# Altium schematic sheet 4.3寸MCU_RGB.SchDoc
size A4
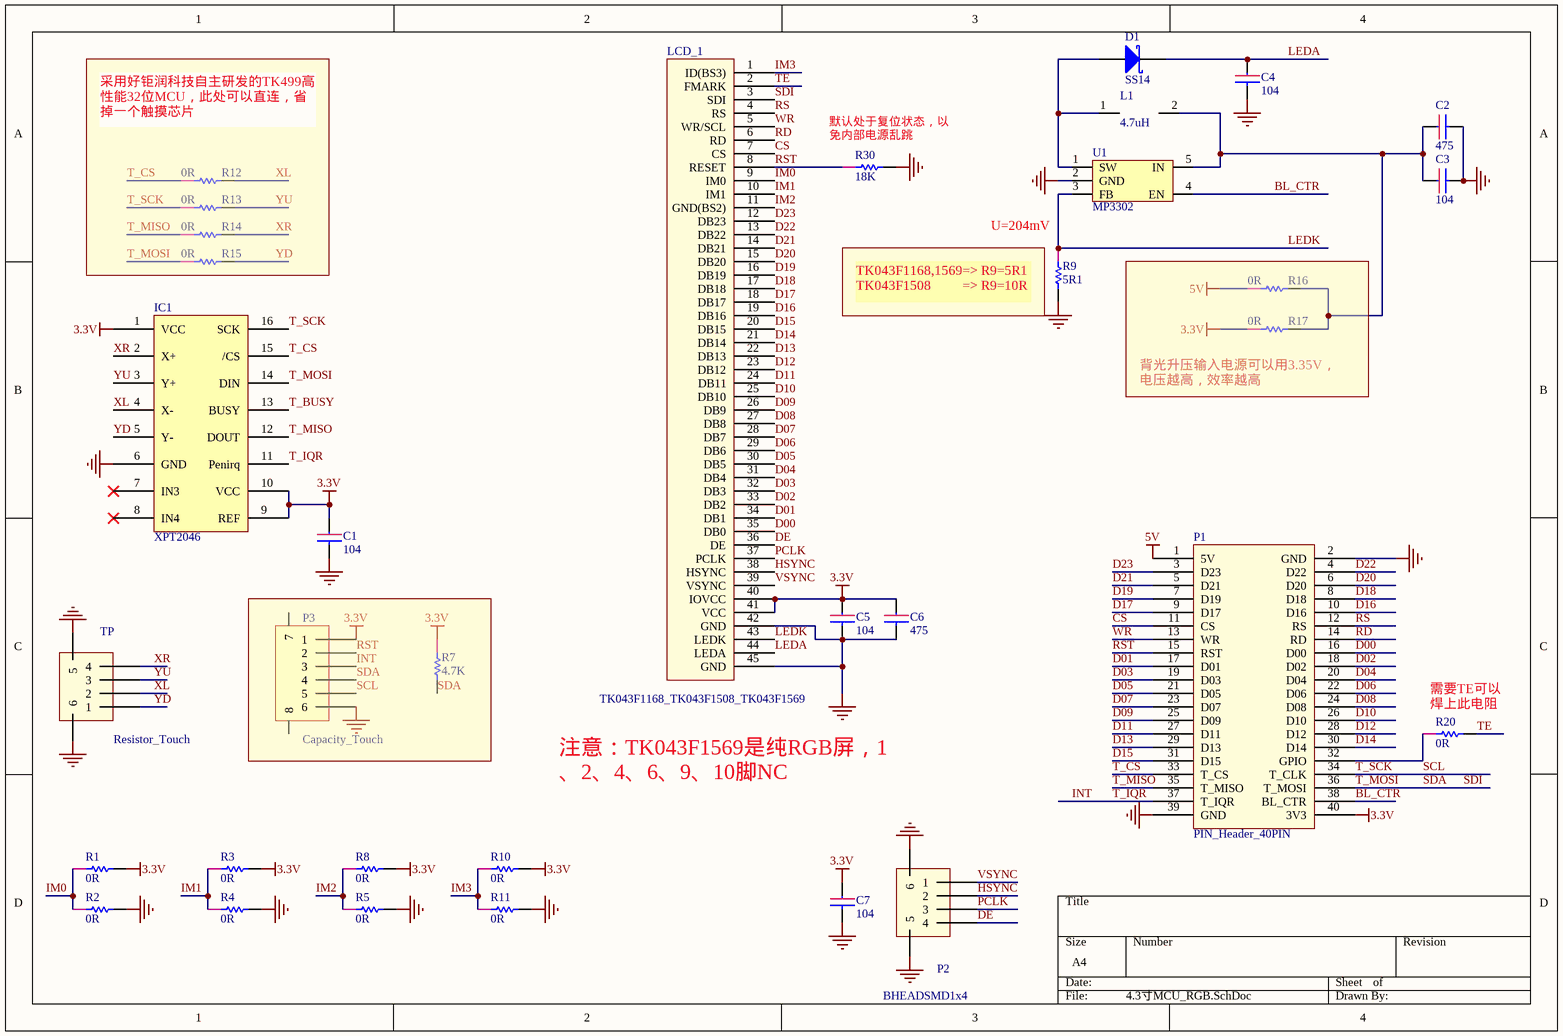
[diagram p0: 4.3寸MCU_RGB.SchDoc]

## Parts
C1  104  [C0603-1]
C2  475  [C0603-2]
C3  104  [C0603-1]
C4  104  [C0603-2]
C5  104  [C0603-1]
C6  475  [C0603-2]
C7  104  [C0603-1]
D1  SS14  [SOD123]
IC1  XPT2046  [SOT403-1]
L1  4.7uH  [L1206]
LCD_1  TK043F1168_TK043F1508_TK043F1569  [TFT_KGM1066A0]
P1  PIN_Header_40PIN  [P_Head_2x20]
P2  BHEADSMD1x4  [BHEADSMD1x4]
P3  Capacity_Touch  [TP_Cap_4.3inch]
R1  0R  [R0603]
R2  0R  [R0603]
R3  0R  [R0603]
R4  0R  [R0603]
R5  0R  [R0603]
R7  4.7K  [R0603]
R8  0R  [R0603]
R9  5R1  [R0603]
R10  0R  [R0603]
R11  0R  [R0603]
R12  0R  [R0402]
R13  0R  [R0402]
R14  0R  [R0402]
R15  0R  [R0402]
R16  0R  [R0603]
R17  0R  [R0603]
R20  0R  [R0603]
R30  18K  [R0603]
TP  Resistor_Touch  [TP_5.0inch]
U1  MP3302  [SOT23-5]

## Nets
3.3V: C1.1 C5.1 C6.1 C7.1 IC1.1(VCC) IC1.9(REF) IC1.10(VCC) LCD_1.40(IOVCC) LCD_1.41(VCC) P1.40(3V3) P3.1 R1.2 R3.2 R7.1 R8.2 R10.2 R17.1
5V: P1.1(5V) R16.1
GND: C1.2 C2.2 C3.2 C4.2 C5.2 C6.2 C7.2 IC1.6(GND) LCD_1.42(GND) LCD_1.45(GND) P1.2(GND) P1.39(GND) P2.5 P2.6 P3.6 R2.2 R4.2 R5.2 R9.2 R11.2 R30.2 TP.5 TP.6 U1.2(GND)
BL_CTR: P1.38(BL_CTR) U1.4(EN)
CS: LCD_1.7(CS) P1.11(CS)
D00: LCD_1.35(DB0) P1.16(D00)
D01: LCD_1.34(DB1) P1.17(D01)
D02: LCD_1.33(DB2) P1.18(D02)
D03: LCD_1.32(DB3) P1.19(D03)
D04: LCD_1.31(DB4) P1.20(D04)
D05: LCD_1.30(DB5) P1.21(D05)
D06: LCD_1.29(DB6) P1.22(D06)
D07: LCD_1.28(DB7) P1.23(D07)
D08: LCD_1.27(DB8) P1.24(D08)
D09: LCD_1.26(DB9) P1.25(D09)
D10: LCD_1.25(DB10) P1.26(D10)
D11: LCD_1.24(DB11) P1.27(D11)
D12: LCD_1.23(DB12) P1.28(D12)
D13: LCD_1.22(DB13) P1.29(D13)
D14: LCD_1.21(DB14) P1.30(D14)
D15: LCD_1.20(DB15) P1.31(D15)
D16: LCD_1.19(DB16) P1.10(D16)
D17: LCD_1.18(DB17) P1.9(D17)
D18: LCD_1.17(DB18) P1.8(D18)
D19: LCD_1.16(DB19) P1.7(D19)
D20: LCD_1.15(DB20) P1.6(D20)
D21: LCD_1.14(DB21) P1.5(D21)
D22: LCD_1.13(DB22) P1.4(D22)
D23: LCD_1.12(DB23) P1.3(D23)
DE: LCD_1.36(DE) P2.4
HSYNC: LCD_1.38(HSYNC) P2.2
IM0: LCD_1.9(IM0) R1.1 R2.1
IM1: LCD_1.10(IM1) R3.1 R4.1
IM2: LCD_1.11(GND(BS2)) R5.1 R8.1
IM3: LCD_1.1(ID(BS3)) R10.1 R11.1
INT: IC1.11(Penirq) P1.37(T_IQR) P3.3  [also labelled T_IQR]
LEDA: C4.1 D1.2(K) LCD_1.44(LEDA)
LEDK: LCD_1.43(LEDK) R9.1 U1.3(FB)
PCLK: LCD_1.37(PCLK) P2.3
RD: LCD_1.6(RD) P1.14(RD)
RS: LCD_1.4(RS) P1.12(RS)
RST: LCD_1.8(RESET) P1.15(RST) P3.2 R30.1
SCL: IC1.16(SCK) P1.34(T_CLK) P3.5 R13.1  [also labelled T_SCK]
SDA: IC1.14(DIN) LCD_1.3(SDI) P1.36(T_MOSI) P3.4 R7.2 R15.1  [also labelled SDI, T_MOSI]
T_BUSY: IC1.13(BUSY)
T_CS: IC1.15(/CS) P1.33(T_CS) R12.1
T_MISO: IC1.12(DOUT) P1.35(T_MISO) R14.1
TE: LCD_1.2(FMARK) R20.2
VSYNC: LCD_1.39(VSYNC) P2.1
WR: LCD_1.5(WR/SCL) P1.13(WR)
XL: IC1.4(X-) R12.2 TP.2
XR: IC1.2(X+) R14.2 TP.4
YD: IC1.5(Y-) R15.2 TP.1
YU: IC1.3(Y+) R13.2 TP.3
NetC2_1: C2.1 C3.1 L1.2 R16.2 R17.2 U1.5(IN)
NetD1_1: D1.1(A) L1.1 U1.1(SW)
NetP1_32: P1.32(GPIO) R20.1

Not connected (* = marked no-connect by the designer): IC1 7(IN3)* 8(IN4)*; P3 7 8

## Notes on the sheet
- 采用好钜润科技自主研发的TK499高性能32位MCU，此处可以直连，省掉一个触摸芯片
- (near R30) 默认处于复位状态，以免内部电源乱跳
- (near R9) U=204mV
- (near R9) TK043F1168,1569=> R9=5R1
  TK043F1508         => R9=10R
- (near R17) 背光升压输入电源可以用3.35V，            电压越高，效率越高
- (near R20) 需要TE可以
  焊上此电阻
- 注意：TK043F1569是纯RGB屏，1、2、4、6、9、10脚NC

## Library data of the parts
C1-C7 = cap
D1 = D Schottky: Schottky Diode; Published: 8-Jun-2000; LatestRevisionDate: 17-Jul-2002; LatestRevisionNote: Re-released for DXP Platform.; PackageReference: SMB; Publisher: Altium Limited; PackageDescription: DO-214-AA/SMB; 2 C-Bend Leads; Body 5.3 x 3.6 mm, inc. leads (LxW); Code_JEDEC: DO-214-AA
IC1 = ADS7843
L1 = Inductor
LCD_1 = TK043F1168
P3 = BHEADSMD1x6
R1-R5 R7-R17 R20 R30 = Resistor
TP = BHEADSMD1x4